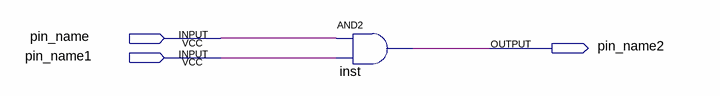
[diagram p0: schematic sheet]
// Quartus schematic ET2.bdf as structural Verilog: 1 symbols, 3 pins
module ET2 (
  input  pin_name,
  input  pin_name1,
  output pin_name2
);

  and inst (pin_name2, pin_name, pin_name1);
endmodule
